# Altium schematic sheet IO.SchDoc
size A; SheetNumber: 3; SheetTotal: 3
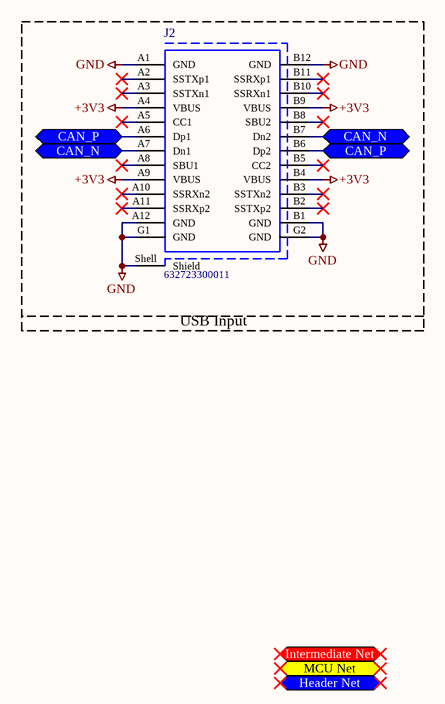
[diagram p0: IO.SchDoc]

## Parts
J2  632723300011  [632723300011]

## Blocks framed on the sheet
USB Input: J2

## Ports
CAN_N (bidir), CAN_P (bidir), Header Net (bidir), Intermediate Net (bidir), MCU Net (bidir)

## Nets
+3V3: J2.A4(VBUS) J2.A9(VBUS) J2.B4(VBUS) J2.B9(VBUS)
GND: J2.A1(GND) J2.A12(GND) J2.B1(GND) J2.B12(GND) J2.G1(GND) J2.G2(GND) J2.Shell(Shield)
CAN_N: J2.A7(Dn1) J2.B7(Dn2) ; port CAN_N
CAN_P: J2.A6(Dp1) J2.B6(Dp2) ; port CAN_P

Not connected (* = marked no-connect by the designer): J2 A2(SSTXp1)* A3(SSTXn1)* A5(CC1)* A8(SBU1)* A10(SSRXn2)* A11(SSRXp2)* B2(SSTXp2)* B3(SSTXn2)* B5(CC2)* B8(SBU2)* B10(SSRXn1)* B11(SSRXp1)*

## Library data of the parts
J2 = CMP-1502-03214-1: USB 3.1 Type C Receptacle WR-COM, Horizontal, SMT / THT; Manufacturer: Wurth Elektronik; Rated Current: 5A; Contact Resistance: 30mOhm; Working Voltage: 20VDC; Operating Temperature: -40to105degC; Package Reference: 632723300011; Datasheet URL: https://katalog.we-online.de/em/datasheet/632723x00011%282%29.pdf; Manufacturer URL: http://www.we-online.de; Connector Type: USB3.1TypeC; Gender: Receptacle; Part Number: 632723300011; Mounting Technology: SMT/THT; Publisher: WurthElektronik; Packaging: TapeandReel; Orientation: Horizontal